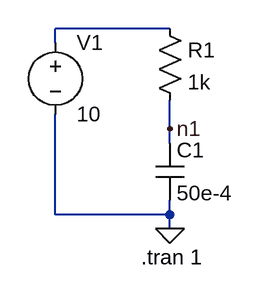
[diagram p0: schematic Draft2.asc]
Draft2.asc, the LTspice schematic file:
Version 4.1
SHEET 1 880 680
WIRE 144 16 16 16
WIRE 16 32 16 16
WIRE 144 128 144 96
WIRE 144 144 144 128
WIRE 16 224 16 112
WIRE 144 224 144 208
WIRE 144 224 16 224
WIRE 144 240 144 224
FLAG 144 128 n1
FLAG 144 240 0
SYMBOL cap 128 144 R0
SYMATTR InstName C1
SYMATTR Value 50e-4
SYMBOL res 128 0 R0
SYMATTR InstName R1
SYMATTR Value 1k
SYMBOL voltage 16 16 R0
SYMATTR InstName V1
SYMATTR Value 10
TEXT 112 272 Left 2 !.tran 1

The netlist it stands for:
* Draft2.asc
C1 n1 0 50e-4
R1 N001 n1 1k
V1 N001 0 10
.tran 1
.backanno
.end